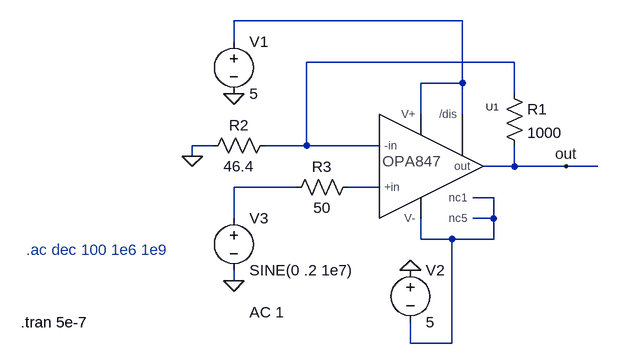
[diagram p0: schematic OPA847_Test.asc]
OPA847_Test.asc, the LTspice schematic file:
Version 4
SHEET 1 880 680
WIRE 256 -80 -96 -80
WIRE -96 -48 -96 -80
WIRE 336 -16 16 -16
WIRE 256 16 256 -80
WIRE 256 16 192 16
WIRE 336 32 336 -16
WIRE 192 64 192 16
WIRE 256 64 256 16
WIRE -128 112 -160 112
WIRE 16 112 16 -16
WIRE 16 112 -48 112
WIRE 128 112 16 112
WIRE -160 128 -160 112
WIRE 336 144 336 112
WIRE 336 144 288 144
WIRE 416 144 336 144
WIRE 464 144 416 144
WIRE 0 176 -96 176
WIRE 128 176 80 176
WIRE 304 192 272 192
WIRE -96 224 -96 176
WIRE 304 224 304 192
WIRE 304 224 272 224
WIRE 192 256 192 224
WIRE 240 256 192 256
WIRE 304 256 304 224
WIRE 304 256 240 256
WIRE -96 320 -96 304
WIRE 176 416 176 384
WIRE 240 416 240 256
WIRE 240 416 176 416
FLAG 176 304 0
FLAG -96 32 0
FLAG -96 320 0
FLAG -160 128 0
FLAG 416 144 out
SYMBOL Opamps\\OPA847-so8 128 224 R0
SYMATTR InstName U1
SYMBOL voltage -96 -64 R0
SYMATTR InstName V1
SYMATTR Value 5
SYMBOL voltage 176 288 R0
SYMATTR InstName V2
SYMATTR Value 5
SYMBOL res 320 16 R0
SYMATTR InstName R1
SYMATTR Value 1000
SYMBOL res -32 96 R90
WINDOW 0 0 56 VBottom 0
WINDOW 3 32 56 VTop 0
SYMATTR InstName R2
SYMATTR Value 46.4
SYMBOL voltage -96 208 R0
WINDOW 123 24 160 Left 0
WINDOW 39 24 132 Left 0
SYMATTR Value2 AC 1
SYMATTR InstName V3
SYMATTR Value SINE(0 .2 1e7)
SYMBOL res 96 160 R90
WINDOW 0 0 56 VBottom 0
WINDOW 3 32 56 VTop 0
SYMATTR InstName R3
SYMATTR Value 50
TEXT -424 384 Left 0 !.tran 5e-7
TEXT -416 272 Left 0 ;.ac dec 100 1e6 1e9

The netlist it stands for:
* OPA847_Test.asc
XU1 N005 N002 N004 N005 N005 out N001 N001 OPA847_Model  ; pins nc1 -in +in V- nc5 out V+ /dis
V1 N001 0 5
V2 0 N005 5
R1 N002 out 1000
R2 N002 0 46.4
V3 N003 0 SINE(0 .2 1e7) AC 1
R3 N004 N003 50
.tran 5e-7
* .ac dec 100 1e6 1e9
.lib OPA847-so8.sub
.backanno
.end